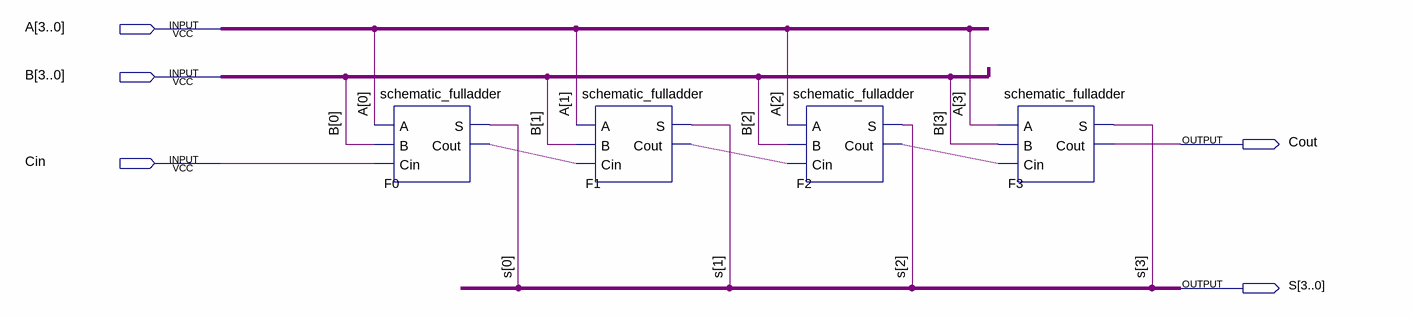
[diagram p0: schematic sheet]
// Quartus schematic 4bitadder.bdf as structural Verilog: 4 symbols, 5 pins
module \4bitadder  (
  input  [3:0] A,
  input  [3:0] B,
  input  Cin,
  output Cout,
  output [3:0] S
);

  wire F0_cout, F1_cout, F2_cout;

  schematic_fulladder F0 (.A(A[0]), .B(B[0]), .Cin(Cin), .S(S[0]), .Cout(F0_cout));
  schematic_fulladder F1 (.A(A[1]), .B(B[1]), .Cin(F0_cout), .S(S[1]), .Cout(F1_cout));
  schematic_fulladder F2 (.A(A[2]), .B(B[2]), .Cin(F1_cout), .S(S[2]), .Cout(F2_cout));
  schematic_fulladder F3 (.A(A[3]), .B(B[3]), .Cin(F2_cout), .S(S[3]), .Cout(Cout));
endmodule
